# EAGLE design breakout (EAGLE 9.6.2)
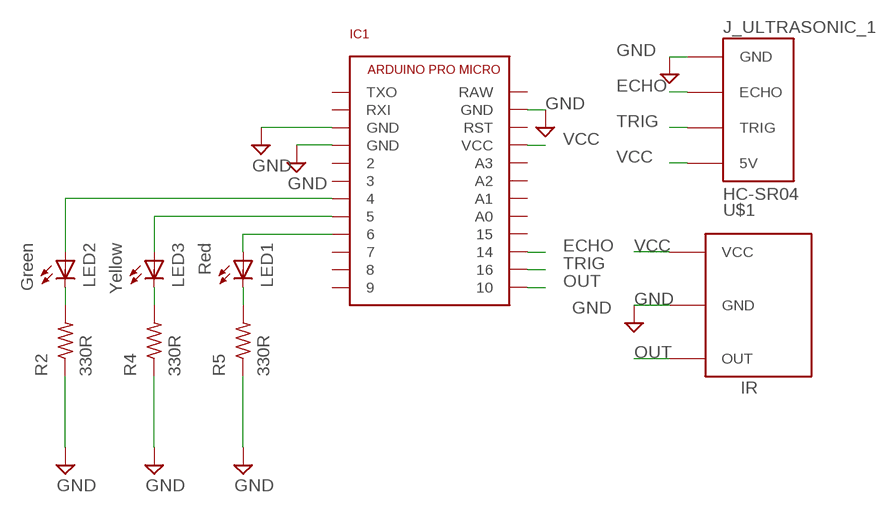
[diagram p0: schematic, sheet 1]

## Parts
IC1  ARDUINO_PRO_MICRO  [ARDUINO_PRO_MICRO]
J_ULTRASONIC_1  HC-SR04  [HC-SR04_FOOTPRINT]
LED1  Red  LED0603  [LED-0603]
LED2  Green  LED0603  [LED-0603]
LED3  Yellow  LED0603  [LED-0603]
R2  330R  R-US_R0603  [R0603]
R4  330R  R-US_R0603  [R0603]
R5  330R  R-US_R0603  [R0603]
U$1  IR  [1X03]

## Nets
ECHO: IC1.14 J_ULTRASONIC_1.ECHO
GND: IC1.GND@0(GND) IC1.GND@1(GND) IC1.GND@2(GND) J_ULTRASONIC_1.GND R2.1 R4.1 R5.1 U$1.2(GND)
N$1: LED1.C R5.2
N$2: IC1.6 LED1.A
N$3: IC1.5 LED3.A
N$4: IC1.4 LED2.A
N$5: LED2.C R2.2
N$6: LED3.C R4.2
OUT: IC1.10 U$1.3(OUT)
TRIG: IC1.16 J_ULTRASONIC_1.TRIG
VCC: IC1.VCC J_ULTRASONIC_1.VCC(5V) U$1.1(VCC)
Unconnected: IC1.2 IC1.3 IC1.7 IC1.8 IC1.9 IC1.15 IC1.A0 IC1.A1 IC1.A2 IC1.A3 IC1.RAW IC1.RST IC1.RXI IC1.TXO

## Library data of the parts
IC1 = pie:ARDUINO_PRO_MICRO: Arduino Pro Micro Electrical System Year 9's Smart Sensor Core Pin Outs <https://cdn.sparkfun.com/assets/9/c/3/c/4/523a1765757b7f5c6e8b4567.png> Buy Here <http://www.aliexpress.com/item/Mini-Leonardo-Pro-Micro-ATmega32U4-5V-16MHz-Module-For-Arduino-Best-Quality/32284746884.html?ws_ab_test=searchweb201556_8,searchweb201602_2_10057_10056_10065_10055_10054_10067_10069_10059_10058_10017_10070_10060_10061_10052_10062_10053_10050_10051,searchweb201603_1&btsid=45993952-29ca-4de4-a0fb-c7fb72b8e1a5> Thru Hole Female Pins <http://www.digikey.com/product-search/en?keywords=929974E-01-12-ND> Surface Mount Female Pins <http://www.digikey.com/product-detail/en/sullins-connector-solutions/NPTC121KFXC-RC/S5604-ND/776062>; DESCRIPTION: Arduino Pro Micro; DISTRIBUTOR: AliExpress; DISTRIBUTOR_PART_NUMBER: 32284746884; MANUFACTURER: Feiyang electronics; NOTES: https://www.aliexpress.com/item/Mini-Leonardo-Pro-Micro-ATmega32U4-5V-16MHz-Module-For-Arduino-Best-Quality/32284746884.html?ws_ab_test=searchweb201556_8,searchweb201602_2_10057_10056_10065_10055_10054_10067_10069_10059_10058_10017_10070_10060_10061_10052_10062_10053_10050_10051,searchweb201603_1&btsid=45993952-29ca-4de4-a0fb-c7fb72b8e1a5; PACKAGE: ARDUINO_PRO_MICRO; REFERENCE_DEST: ARDUINO_PRO_MICRO
J_ULTRASONIC_1 = pie:HC-SR04: Ultrasonic Sensor HC-SR04
LED1-LED3 = pie:LED: LEDs Standard schematic elements and footprints for 5mm, 3mm, 1206, and 0603 sized LEDs. 5mm - Spark Fun Electronics SKU : COM-00529 (and others); DESCRIPTION: LEDs; DISTRIBUTOR: DigiKey; DISTRIBUTOR_PART_NUMBER: 160-1415-1-ND; MANUFACTURER: Lite-On Inc; MANUFACTURER_PART_NUMBER: LTST-C170KRKT; PACKAGE: LED0603; VALUE: COLOR
R2 R4 R5 = pie:R-US_: RESISTOR, American symbol; DESCRIPTION: RESISTOR, American symbol; DISTRIBUTOR: DigiKey; MANUFACTURER: Rohm Semiconductor; NOTES: Cut Tape; PACKAGE: R0603; VALUE: >VALUE
U$1 = pie:IR

## Board
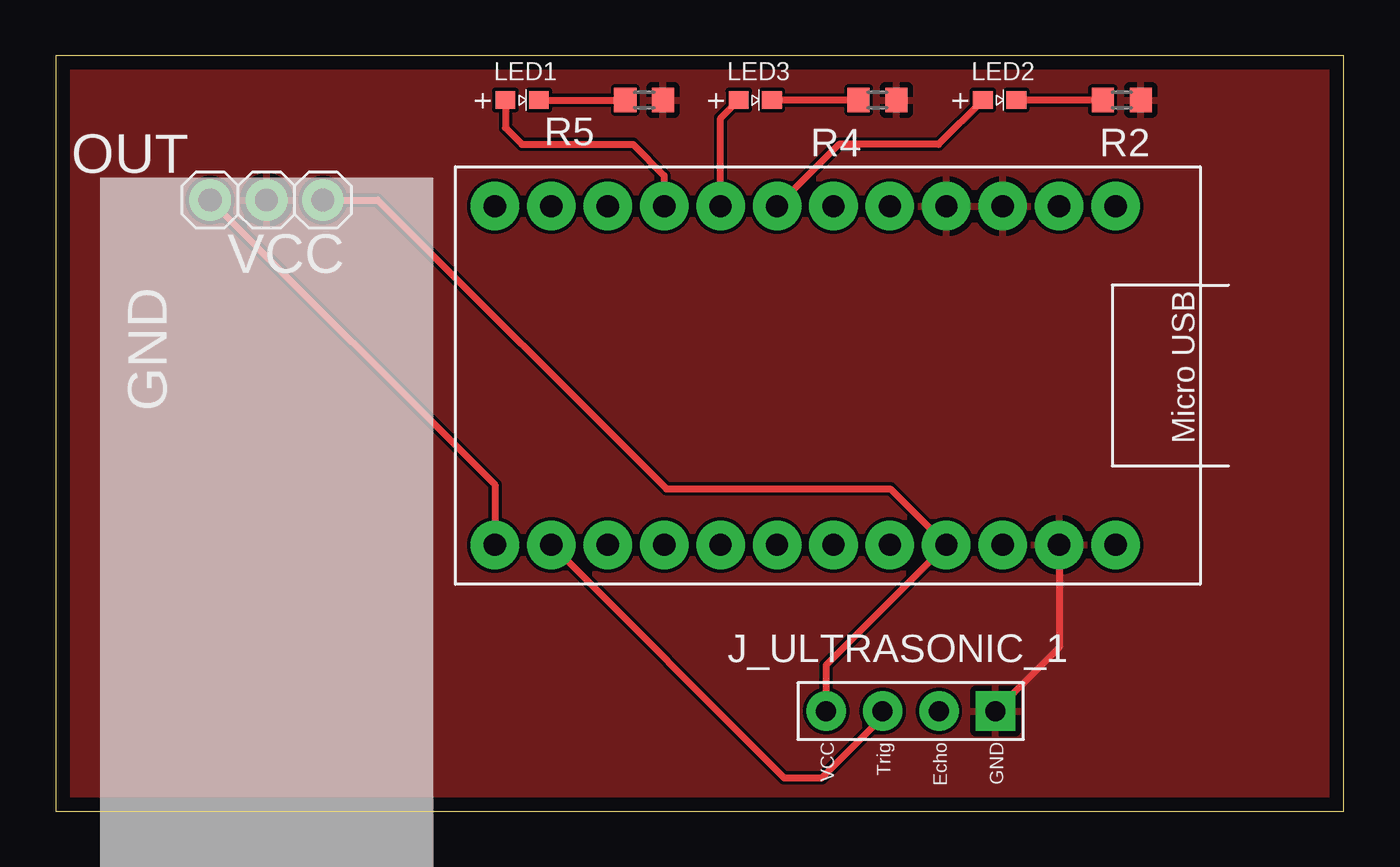
[diagram p1: board, top side]
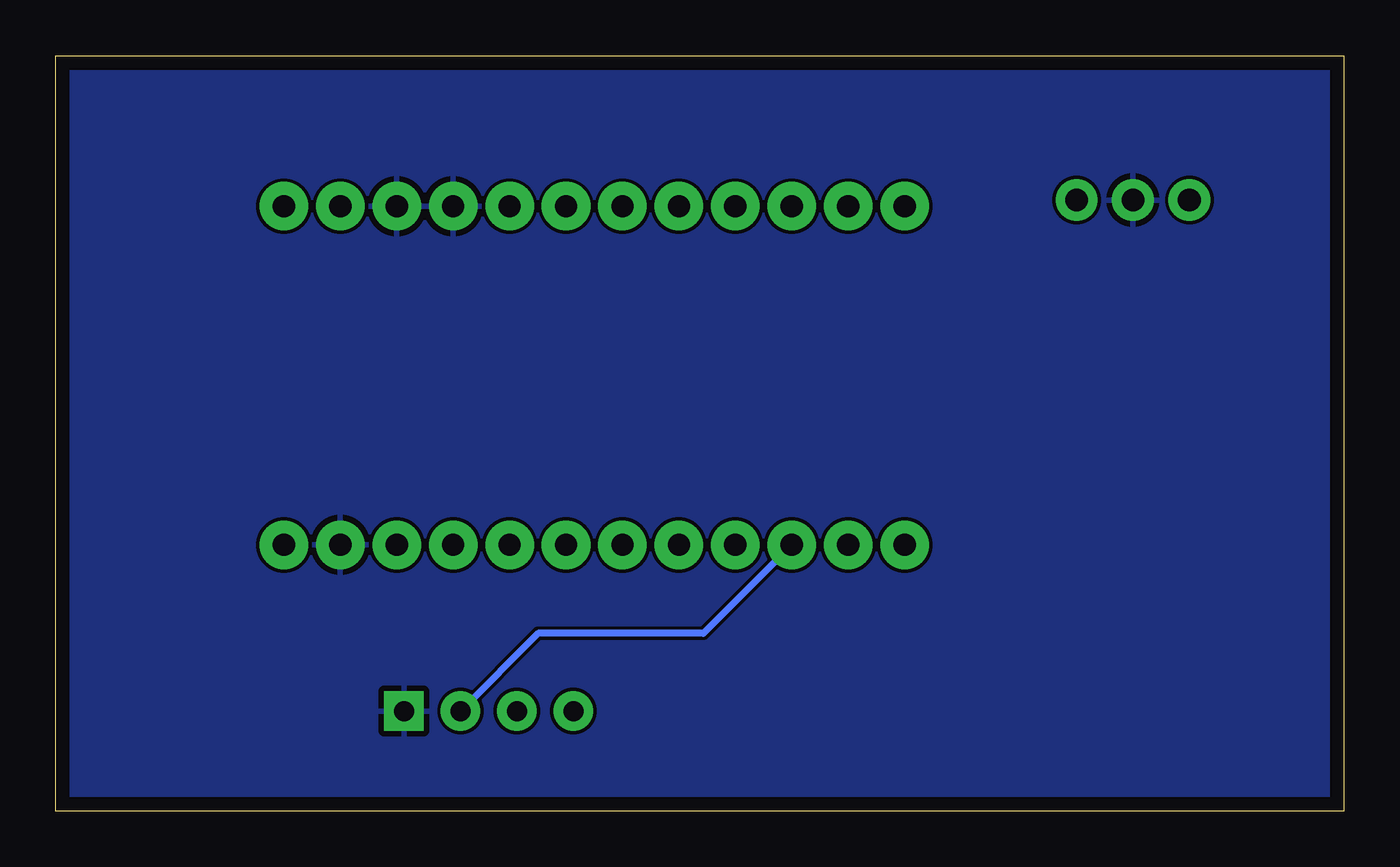
[diagram p2: board, bottom side, seen from below]

Size 58 x 34 mm. Coordinates in mm from the lower left corner, seen from the top.
Outline: 0,0 58,0 58,34 0,34 0,0
Copper layers (1*16): Top 2mil / dielectric 9mil / Bottom 2mil
Design rules "pie": minimum track width 6mil, minimum drill 15mil, track to track 6mil, track to pad 6mil, pad to pad 6mil, via to via 6mil, smd to smd 6mil, copper to edge 25mil, drill to drill 7mil, minimum pad ring 7mil, minimum via ring 7mil, stop-mask expansion 3mil, vias tented up to drill 21mil, thermal gap 10mil

### Footprints (pad centres in the part's own frame; a part is rotated, then mirrored left to right if it is on the bottom)
ARDUINO_PRO_MICRO = drill 1 pad 2.184: 2 1.778,19.558; 3 1.778,17.018; 4 1.778,14.478; 5 1.778,11.938; 6 1.778,9.398; 7 1.778,6.858; 8 1.778,4.318; 9 1.778,1.778; 10 17.018,1.778; 14 17.018,6.858; 15 17.018,9.398; 16 17.018,4.318; A0 17.018,11.938; A1 17.018,14.478; A2 17.018,17.018; A3 17.018,19.558; GND@0 1.778,24.638; GND@1 1.778,22.098; GND@2 17.018,27.178; RAW 17.018,29.718; RST 17.018,24.638; RXI 1.778,27.178; TXO 1.778,29.718; VCC 17.018,22.098
HC-SR04_FOOTPRINT = drill 0.9 pad 1.778: ECHO 0,1.27; TRIG 0,-1.27; VCC 0,-3.81 | drill 0.9 pad 1.778 square: GND 0,3.81
LED-0603 = smd 0.8 x 0.889: A 0,-0.75; C 0,0.75
R0603 = smd 1 x 1.1: 1 -0.85,0; 2 0.85,0
1X03 = drill 1.016 pad 1.88: 1 -2.54,0; 2 0,0; 3 2.54,0

### Placement (x,y rotation side)
IC1  18,29 270 top
J_ULTRASONIC_1  38.5,4.5 270 top
LED1  21,32 270 top
LED2  42.5,32 270 top
LED3  31.5,32 270 top
R2  48,32 180 top
R4  37,32 180 top
R5  26.5,32 180 top
U$1  9.5,27.5 180 top

### Tracks (layer width: path | path; a pad name or v marks a point on that pad's centre or on a via)
ECHO
  Bottom 0.305: IC1.14 28.84,8 36.27,8 J_ULTRASONIC_1.ECHO
GND
  Top 0.305: IC1.GND@2 45.18,7.37 J_ULTRASONIC_1.GND
  pour Top: 0,34 0,0 58,0 58,34
  pour Bottom: 0,34 0,0 58,0 58,34
N$1
  Top 0.305: LED1.C R5.2
N$2
  Top 0.305: LED1.A 20.25,30.75 21,30 26,30 27.4,28.6 IC1.6
N$3
  Top 0.305: IC1.5 29.94,31.19 LED3.A
N$4
  Top 0.305: IC1.4 35.26,30 39.75,30 LED2.A
N$5
  Top 0.305: R2.2 LED2.C
N$6
  Top 0.305: R4.2 LED3.C
OUT
  Top 0.305: U$1.3 19.78,14.68 IC1.10
TRIG
  Top 0.305: IC1.16 32.8,1.5 34.5,1.5 37.23,4.23 J_ULTRASONIC_1.TRIG
VCC
  Top 0.305: J_ULTRASONIC_1.VCC 34.69,6.57 IC1.VCC 37.58,14.5 27.5,14.5 14.5,27.5 U$1.1

### Text on the board
tNames: OUT | VCC | GND